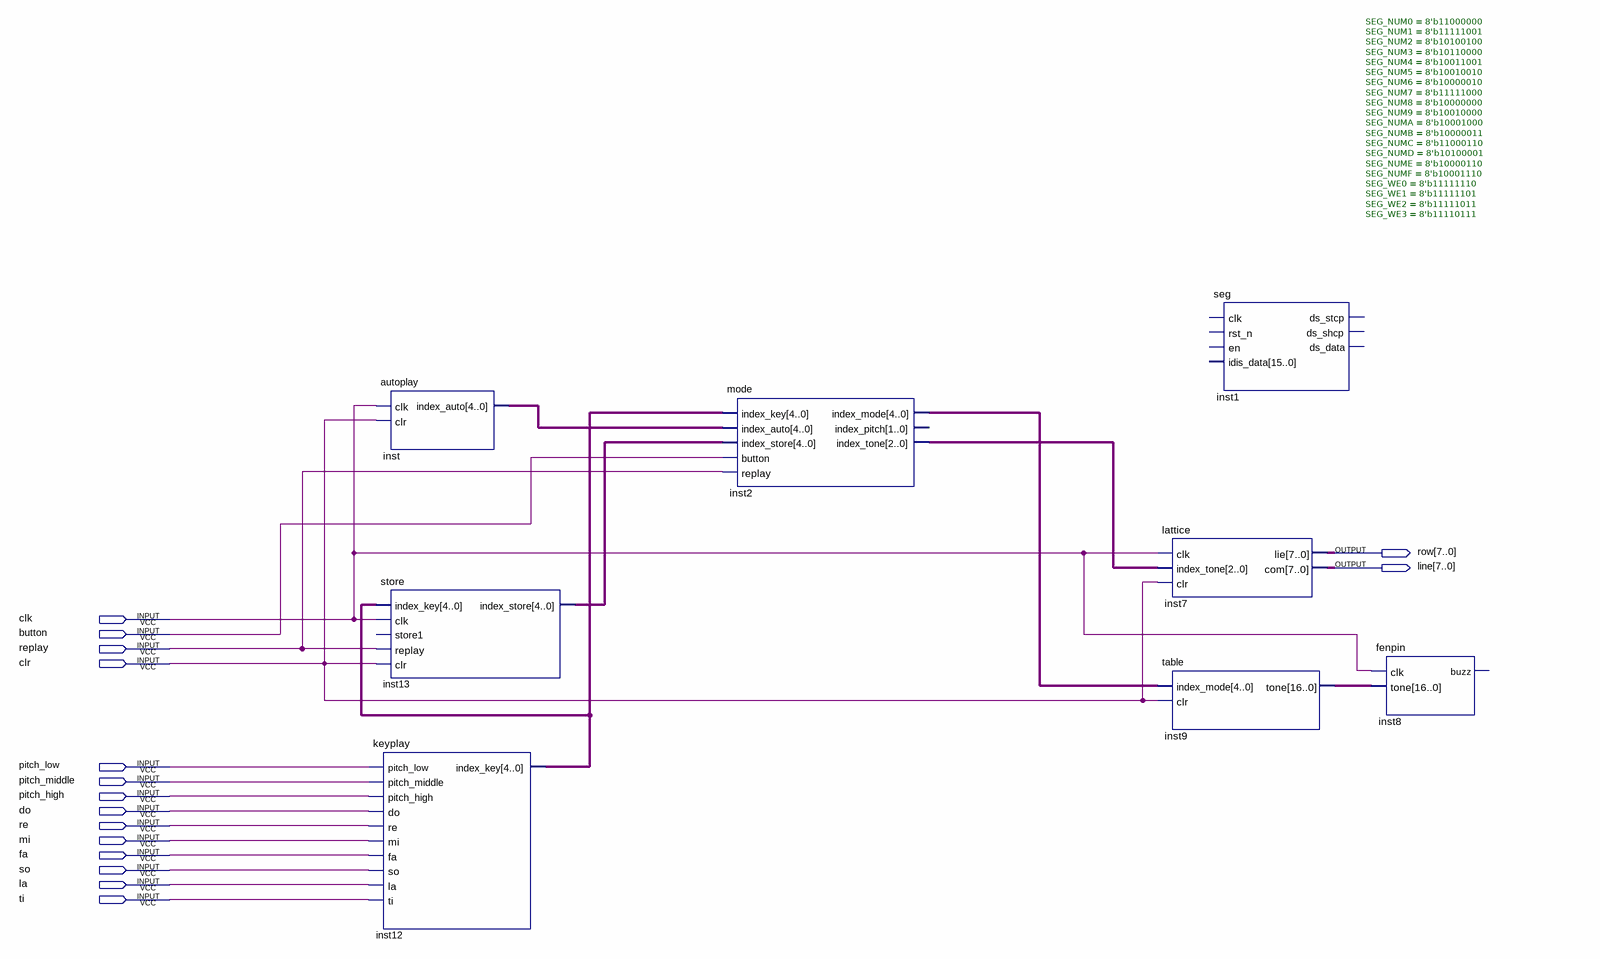
[diagram p0: schematic sheet]
// Quartus schematic test.bdf as structural Verilog: 8 symbols, 16 pins
module test (
  input  clk,
  input  button,
  input  replay,
  input  clr,
  input  pitch_low,
  input  pitch_middle,
  input  pitch_high,
  input  \do ,
  input  re,
  input  mi,
  input  fa,
  input  so,
  input  la,
  input  ti,
  output [7:0] row,
  output [7:0] line
);

  wire [2:0] inst2_index_tone;
  wire [4:0] inst2_index_mode, inst12_index_key, inst13_index_store, inst_index_auto;
  wire [16:0] inst9_tone;

  autoplay inst (.clk(clk), .clr(clr), .index_auto(inst_index_auto));
  store inst13 (
    .index_key(inst12_index_key), .clk(clk), .replay(replay), .clr(clr), .index_store(inst13_index_store));  // open: store1
  keyplay inst12 (
    .pitch_low(pitch_low), .pitch_middle(pitch_middle), .pitch_high(pitch_high), .\do (\do ), .re(re),
    .mi(mi), .fa(fa), .so(so), .la(la), .ti(ti), .index_key(inst12_index_key));
  mode inst2 (
    .index_key(inst12_index_key), .index_auto(inst_index_auto), .index_store(inst13_index_store),
    .button(button), .replay(replay), .index_mode(inst2_index_mode), .index_tone(inst2_index_tone));  // open: index_pitch
  lattice inst7 (.clk(clk), .index_tone(inst2_index_tone), .clr(clr), .lie(row), .com(line));
  \table  inst9 (.index_mode(inst2_index_mode), .clr(clr), .tone(inst9_tone));
  seg #(.SEG_NUM0(8'b11000000), .SEG_NUM1(8'b11111001), .SEG_NUM2(8'b10100100), .SEG_NUM3(8'b10110000), .SEG_NUM4(8'b10011001), .SEG_NUM5(8'b10010010), .SEG_NUM6(8'b10000010), .SEG_NUM7(8'b11111000), .SEG_NUM8(8'b10000000), .SEG_NUM9(8'b10010000), .SEG_NUMA(8'b10001000), .SEG_NUMB(8'b10000011), .SEG_NUMC(8'b11000110), .SEG_NUMD(8'b10100001), .SEG_NUME(8'b10000110), .SEG_NUMF(8'b10001110), .SEG_WE0(8'b11111110), .SEG_WE1(8'b11111101), .SEG_WE2(8'b11111011), .SEG_WE3(8'b11110111)) inst1 ();  // open: clk, rst_n, en, idis_data, ds_stcp, ds_shcp, ds_data
  fenpin inst8 (.clk(clk), .tone(inst9_tone));  // open: buzz
endmodule
